# Altium schematic sheet IMX6ULL_CORE_sch8.SchDoc
size A4
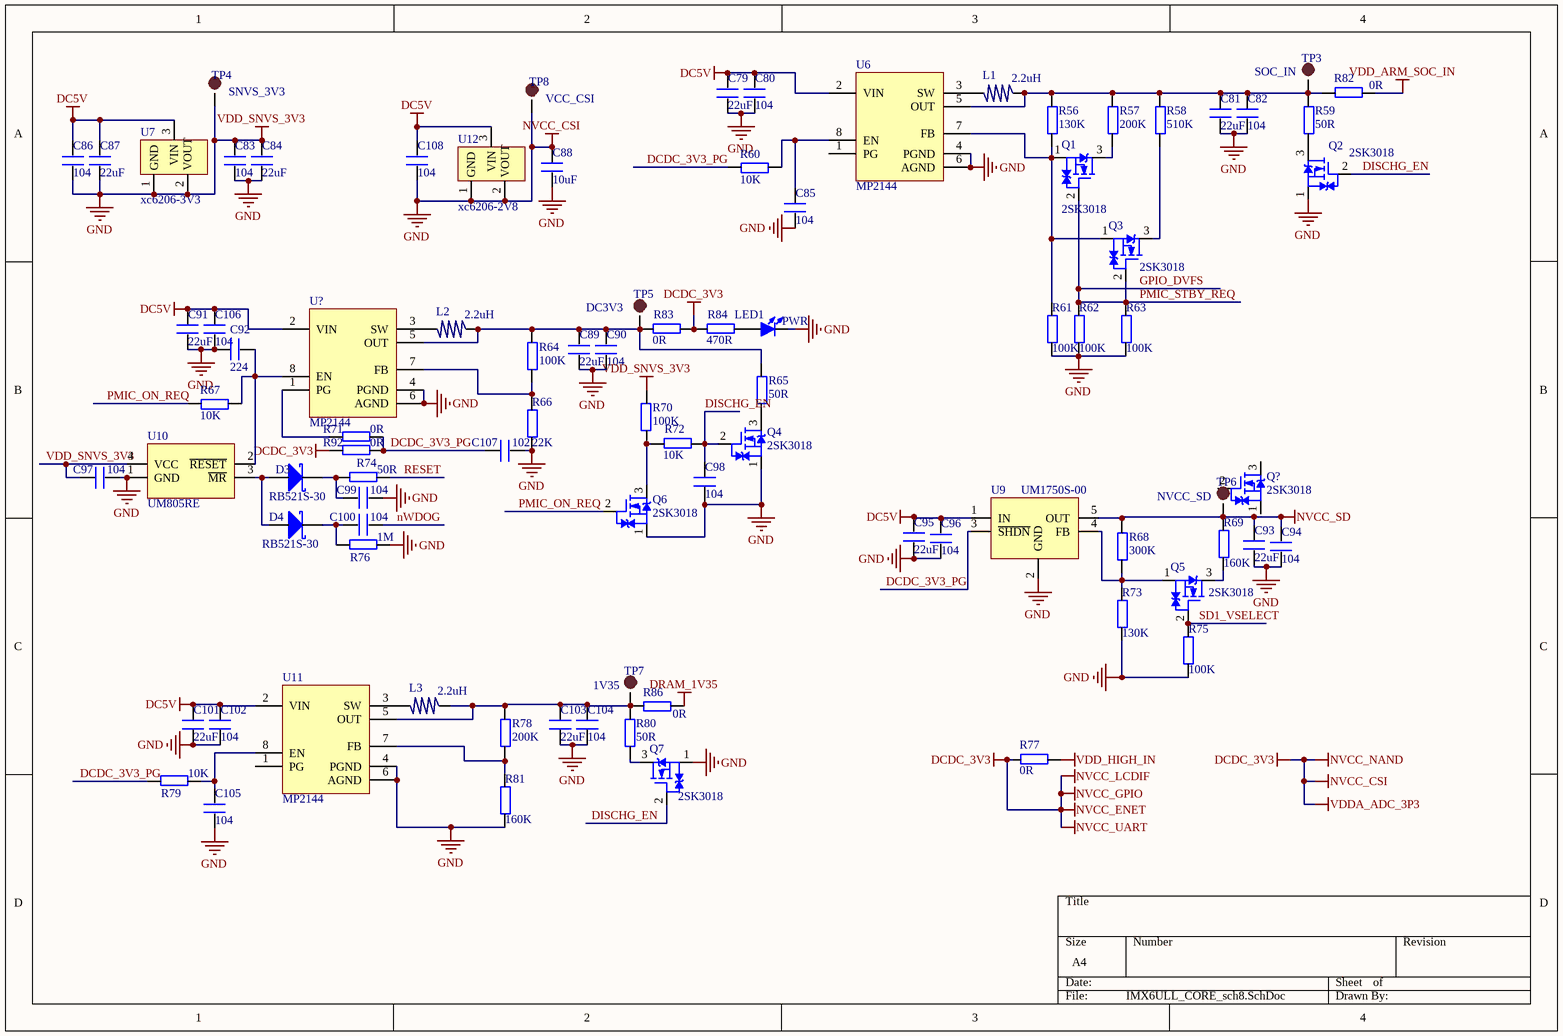
[diagram p0: IMX6ULL_CORE_sch8.SchDoc]

## Parts
C79  22uF  [0805]
C80  104  [C 0402]
C81  22uF  [0805]
C82  104  [C 0402]
C83  104  [C 0402]
C84  22uF  [0805]
C85  104  [C 0402]
C86  104  [C 0402]
C87  22uF  [0805]
C88  10uF  [0805]
C89  22uF  [0805]
C90  104  [C 0402]
C91  22uF  [0805]
C92  224  [C 0402]
C93  22uF  [0805]
C94  104  [C 0402]
C95  22uF  [0805]
C96  104  [C 0402]
C97  104  [C 0402]
C98  104  [C 0402]
C99  104  [C 0402]
C100  104  [C 0402]
C101  22uF  [0805]
C102  104  [C 0402]
C103  22uF  [0805]
C104  104  [C 0402]
C105  104  [C 0402]
C106  104  [C 0402]
C107  102  [C 0402]
C108  104  [C 0402]
D3  RB521S-30  [SOD-523]
D4  RB521S-30  [SOD-523]
L1  2.2uH  [NR3015]
L2  2.2uH  [NR3015]
L3  2.2uH  [NR3015]
LED1  PWR  [LED 0603B]
Q1  2SK3018  [SC70-3L]
Q2  2SK3018  [SC70-3L]
Q3  2SK3018  [SC70-3L]
Q4  2SK3018  [SC70-3L]
Q5  2SK3018  [SC70-3L]
Q6  2SK3018  [SC70-3L]
Q7  2SK3018  [SC70-3L]
Q?  2SK3018  [SC70-3L]
R56  130K  [R 0402]
R57  200K  [R 0402]
R58  510K  [R 0402]
R59  50R  [R 0402]
R60  10K  [R 0402]
R61  100K  [R 0402]
R62  100K  [R 0402]
R63  100K  [R 0402]
R64  100K  [R 0402]
R65  50R  [R 0402]
R66  22K  [R 0402]
R67  10K  [R 0402]
R68  300K  [R 0402]
R69  160K  [R 0402]
R70  100K  [R 0402]
R71  0R  [R 0402]
R72  10K  [R 0402]
R73  130K  [R 0402]
R74  50R  [R 0402]
R75  100K  [R 0402]
R76  1M  [R 0402]
R77  0R  [R 0402]
R78  200K  [R 0402]
R79  10K  [R 0402]
R80  50R  [R 0402]
R81  160K  [R 0402]
R82  0R  [R 0402]
R83  0R  [R 0402]
R84  470R  [R 0402]
R86  0R  [R 0402]
R92  0R  [R 0402]
TP3  SOC_IN  [TP-1.0]
TP4  SNVS_3V3  [TP-1.0]
TP5  DC3V3  [TP-1.0]
TP6  NVCC_SD  [TP-1.0]
TP7  1V35  [TP-1.0]
TP8  VCC_CSI  [TP-1.0]
U6  MP2144  [SOT23-8L]
U7  xc6206-3V3  [SOT23-3L]
U9  UM1750S-00  [SOT23-5L]
U10  UM805RE  [SOT143]
U11  MP2144  [SOT23-8L]
U12  xc6206-2V8  [SOT23-3L]
U?  MP2144  [SOT23-8L]

## Nets
DC5V: C79.2 C80.2 C86.2 C87.2 C91.2 C95.2 C96.2 C101.2 C102.2 C106.2 C108.2 U6.2(VIN) U7.3(VIN) U9.1(IN) U11.2(VIN) U12.3(VIN) U?.2(VIN)
DRAM_1V35: R86.2
NVCC_SD: C93.2 C94.2 R68.2 R69.2 TP6.1 U9.5(OUT)
VDD_ARM_SOC_IN: R82.1
VDD_HIGH_IN: R77.1
VDD_SNVS_3V3: C79.1 C80.1 C81.1 C82.1 C83.1 C83.2 C84.1 C84.2 C85.1 C86.1 C87.1 C88.1 C88.2 C89.1 C90.1 C91.1 C92.2 C93.1 C94.1 C95.1 C96.1 C97.1 C97.2 C98.1 C99.1 C101.1 C102.1 C103.1 C104.1 C105.1 C106.1 C107.1 C108.1 LED1.2(K) Q2.1(S) Q4.1(S) Q6.1(S) Q7.1(S) R61.1 R62.1 R63.1 R66.1 R70.1 R73.1 R75.1 R76.1 R77.2 R81.1 R83.1 R84.2 R92.2 TP4.1 TP8.1 U6.4(PGND) U6.6(AGND) U7.1(GND) U7.2(VOUT) U9.2(GND) U10.1(GND) U10.4(VCC) U11.4(PGND) U11.6(AGND) U12.1(GND) U12.2(VOUT) U?.4(PGND) U?.6(AGND)  [also labelled DCDC_3V3, GND, NVCC_CSI, NVCC_ENET, NVCC_GPIO, NVCC_LCDIF, NVCC_NAND, NVCC_UART, VDDA_ADC_3P3]
DCDC_3V3_PG: C107.2 R60.1 R71.1 R79.2 R92.1 U9.3(~{SHDN})
DISCHG_EN: C98.2 Q2.2(G) Q4.2(G) Q7.2(G) R72.1
GPIO_DVFS: Q1.2(G) Q3.2(G) R62.2 R63.2  [also labelled PMIC_STBY_REQ]
nWDOG: C100.1
PMIC_ON_REQ: Q6.2(G) R67.1
RESET: R74.1
SD1_VSELECT: Q5.2(G) R75.2
NetC81_2: C81.2 C82.2 L1.1 R56.2 R57.2 R58.2 R59.2 R82.2 TP3.1 U6.5(OUT)
NetC85_2: C85.2 R60.2 U6.8(EN)
NetC89_2: C89.2 C90.2 L2.1 R64.2 R65.2 R83.2 TP5.1 U?.5(OUT)
NetC92_1: C92.1 R67.2 U10.2(~{RESET}) U?.8(EN)
NetC99_2: C99.2 D3.2(C) R74.2
NetC100_2: C100.2 D4.2(C) R76.2
NetC103_2: C103.2 C104.2 L3.1 R78.2 R80.1 R86.1 TP7.1 U11.5(OUT)
NetC105_2: C105.2 R79.1 U11.8(EN)
NetD3_1: D3.1(A) D4.1(A) U10.3(~{MR})
NetL1_2: L1.2 U6.3(SW)
NetL2_2: L2.2 U?.3(SW)
NetL3_2: L3.2 U11.3(SW)
NetLED1_1: LED1.1(A) R84.1
NetQ1_1: Q1.1(S) Q3.1(S) R56.1 R61.2 U6.7(FB)
NetQ1_3: Q1.3(D) R57.1
NetQ2_3: Q2.3(D) R59.1
NetQ3_3: Q3.3(D) R58.1
NetQ4_3: Q4.3(D) R65.1
NetQ5_1: Q5.1(S) R68.1 R73.2 U9.4(FB)
NetQ5_3: Q5.3(D) R69.1
NetQ6_3: Q6.3(D) R70.2 R72.2
NetQ7_3: Q7.3(D) R80.2
NetR64_1: R64.1 R66.2 U?.7(FB)
NetR71_2: R71.2 U?.1(PG)
NetR78_1: R78.1 R81.2 U11.7(FB)

Not connected (* = marked no-connect by the designer): Q? 1(S) 2(G) 3(D); U6 1(PG); U11 1(PG)

## Library data of the parts
C79-C108 = C
L1-L3 = L
LED1 = LED-SMD: 贴片LED; 版权归属: 源创客; BOM名称: 贴片LED; 学习资源: www.ooocke.com
Q1-Q7 Q? = 2SK3018: N沟场效应管  30V,0.1A; 版权归属: 源创客; BOM名称: N沟场效应管; 学习资源: www.ooocke.com
R56-R84 R86 R92 = R
TP3-TP8 = TEST-POINT: 测试点
U11 = MP2159
U12 = xc6206-3V3